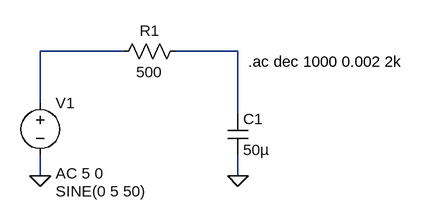
[diagram p0: schematic lowpass.asc]
lowpass.asc, the LTspice schematic file:
Version 4.1
SHEET 1 880 680
WIRE 208 80 80 80
WIRE 384 80 288 80
WIRE 80 160 80 80
WIRE 384 176 384 80
WIRE 80 272 80 240
WIRE 384 272 384 240
FLAG 80 272 0
FLAG 384 272 0
SYMBOL voltage 80 144 R0
WINDOW 3 24 152 Left 2
WINDOW 123 24 124 Left 2
WINDOW 39 0 0 Left 0
SYMATTR InstName V1
SYMATTR Value SINE(0 5 50)
SYMATTR Value2 AC 5 0
SYMBOL res 304 64 R90
WINDOW 0 0 56 VBottom 2
WINDOW 3 32 56 VTop 2
SYMATTR InstName R1
SYMATTR Value 500
SYMBOL cap 368 176 R0
SYMATTR InstName C1
SYMATTR Value 50µ
TEXT 400 96 Left 2 !.ac dec 1000 0.002 2k

The netlist it stands for:
* lowpass.asc
V1 N001 0 SINE(0 5 50) AC 5 0
R1 N002 N001 500
C1 N002 0 50µ
.ac dec 1000 0.002 2k
.backanno
.end